# Altium schematic sheet SENSOR.SchDoc
size A4; SheetNumber: 2; SheetTotal: 3
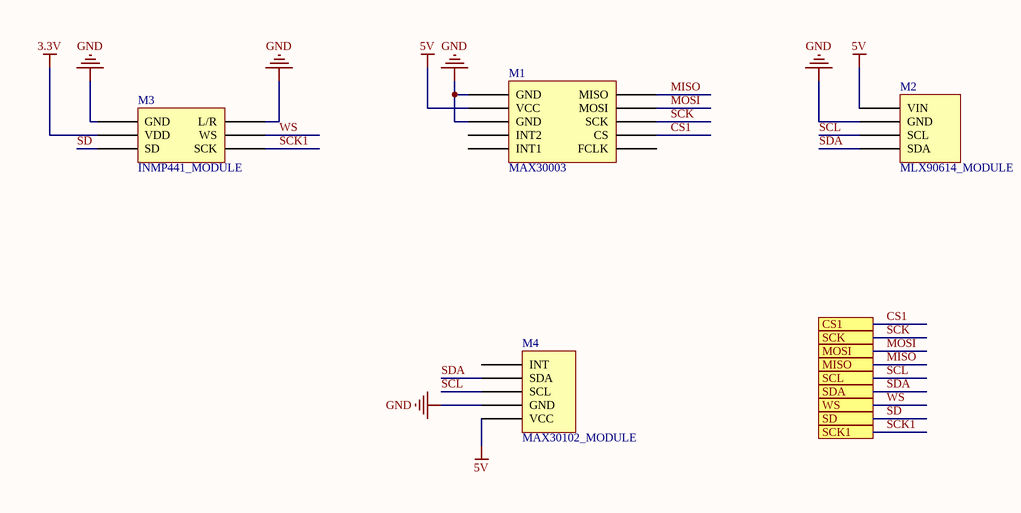
[diagram p0: SENSOR.SchDoc]

## Parts
M1  MAX30003  [MAX30003]
M2  MLX90614_MODULE  [MLX90614_MODULE]
M3  INMP441_MODULE  [INMP441_MODULE]
M4  MAX30102_MODULE  [MAX30102_module]

## Ports
CS1, MISO, MOSI, SCK, SCK1, SCL, SD, SDA, WS

## Nets
3.3V: M3.2(VDD)
5V: M1.VCC M2.1(VIN) M4.5(VCC)
GND: M1.GND M2.2(GND) M3.1(GND) M3.4(L/R) M4.4(GND)
CS1: M1.CS ; port CS1
MISO: M1.MISO ; port MISO
MOSI: M1.MOSI ; port MOSI
SCK: M1.SCK ; port SCK
SCK1: M3.6(SCK) ; port SCK1
SCL: M2.3(SCL) M4.3(SCL) ; port SCL
SD: M3.3(SD) ; port SD
SDA: M2.4(SDA) M4.2(SDA) ; port SDA
WS: M3.5(WS) ; port WS

Not connected (* = marked no-connect by the designer): M1 FCLK INT1 INT2; M4 1(INT)